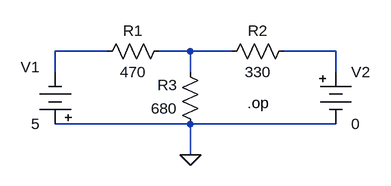
[diagram p0: schematic Super.asc]
Super.asc, the LTspice schematic file:
Version 4
SHEET 1 880 680
WIRE 32 96 -48 96
WIRE 160 96 112 96
WIRE 224 96 160 96
WIRE 384 96 304 96
WIRE -48 128 -48 96
WIRE 160 128 160 96
WIRE 384 128 384 96
WIRE 160 208 -48 208
WIRE 384 208 160 208
WIRE 160 256 160 208
FLAG 160 256 0
DATAFLAG 160 128 ""
SYMBOL res 128 80 R90
WINDOW 0 0 56 VBottom 2
WINDOW 3 32 56 VTop 2
SYMATTR InstName R1
SYMATTR Value 470
SYMBOL res 320 80 R90
WINDOW 0 0 56 VBottom 2
WINDOW 3 32 56 VTop 2
SYMATTR InstName R2
SYMATTR Value 330
SYMBOL res 176 224 R180
WINDOW 0 36 76 Left 2
WINDOW 3 36 40 Left 2
SYMATTR InstName R3
SYMATTR Value 680
SYMBOL Misc\\battery -48 224 R180
WINDOW 0 24 104 Left 2
WINDOW 3 24 16 Left 2
SYMATTR InstName V1
SYMATTR Value 5
SYMBOL Misc\\battery 384 112 R0
SYMATTR InstName V2
SYMATTR Value 0
TEXT 248 176 Left 2 !.op

The netlist it stands for:
* Super.asc
R1 N002 N001 470
R2 N003 N002 330
R3 0 N002 680
V1 0 N001 5
V2 N003 0 0
.op
.backanno
.end